# EAGLE design lt1345 (EAGLE 8.2.1)
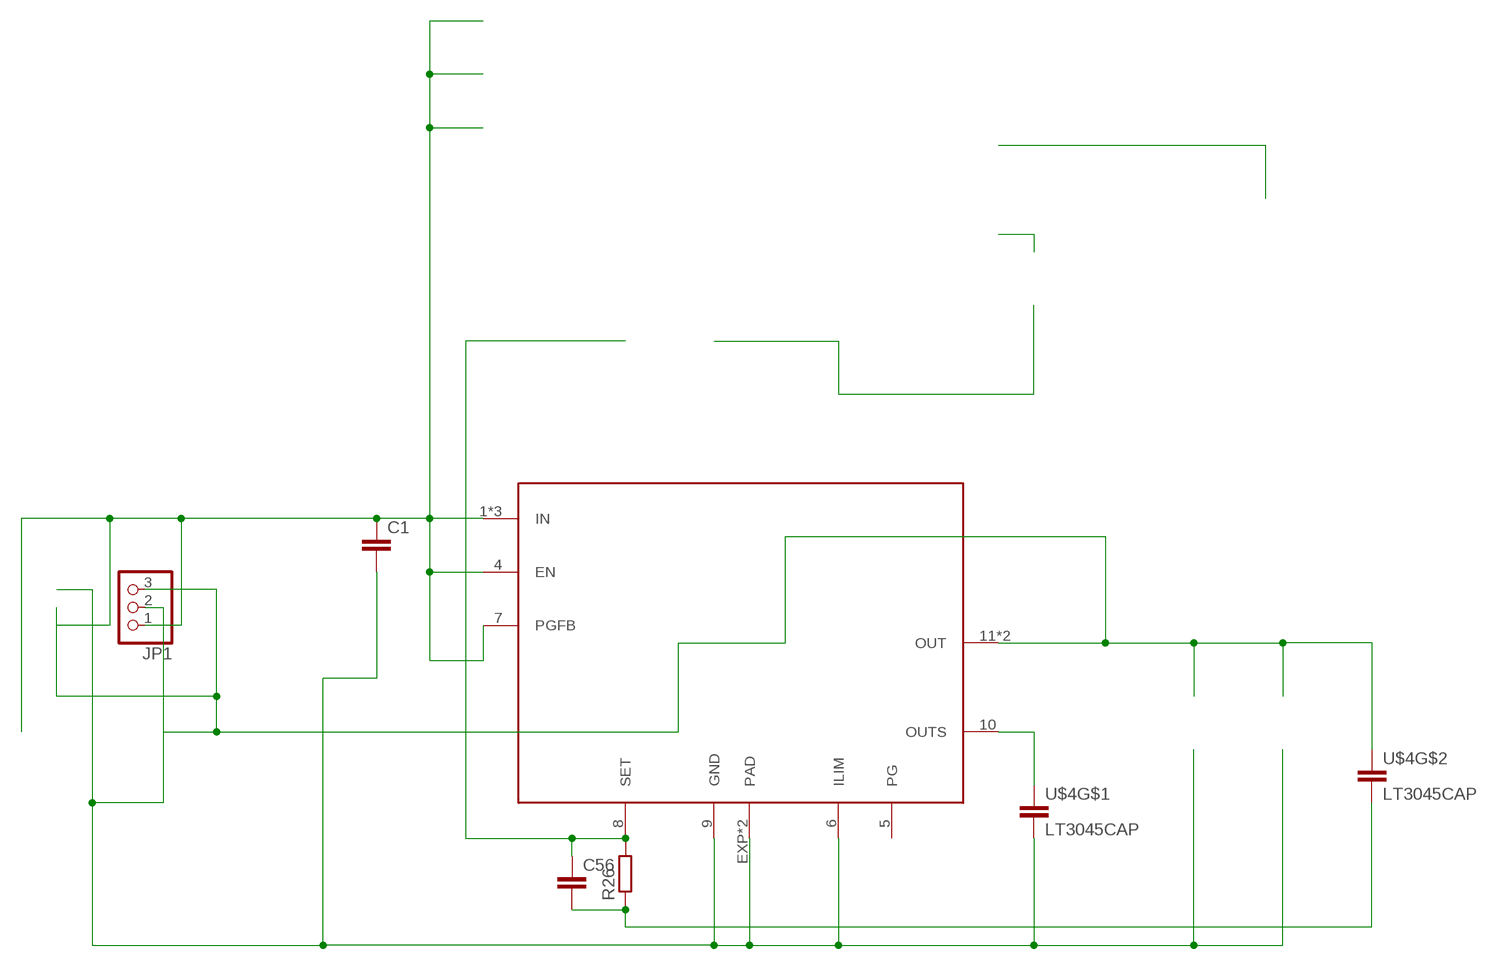
[diagram p0: schematic, sheet 1]

## Parts
C1  C-EUC1206  [C1206]
C56  C-EUC0805  [C0805]
JP1  PINHD-1X3  [1X03]
R26  R-EU_MELF0204R  [MINI_MELF-0204R]
U$2  LT3045  [MSOP12]
U$4  LT3045CAP  [LT3045CAP]

## Nets
GND: C1.2 JP1.2 U$2.6(ILIM) U$2.9(GND) U$2.EXP1(PAD) U$2.EXP(PAD) U$4.5
N$46: C56.1 R26.2 U$2.8(SET)
N$49: U$2.10(OUTS) U$4.3
N$54: C56.2 R26.1 U$4.6
VIN: C1.1 JP1.1 U$2.1(IN) U$2.2(IN) U$2.3(IN) U$2.4(EN) U$2.7(PGFB)
VOUT: JP1.3 U$2.11(OUT) U$2.12(OUT) U$4.4
Unconnected: U$2.5(PG)

## Library data of the parts
C1 C56 = Vwvwbg:C-EU: CAPACITOR, European symbol
JP1 = pinhead:PINHD-1X3: PIN HEADER
R26 = Vwvwbg:R-EU_: RESISTOR, European symbol
U$2 = Vwvwbg:LT3045
U$4 = Vwvwbg:LT3045CAP

## Board
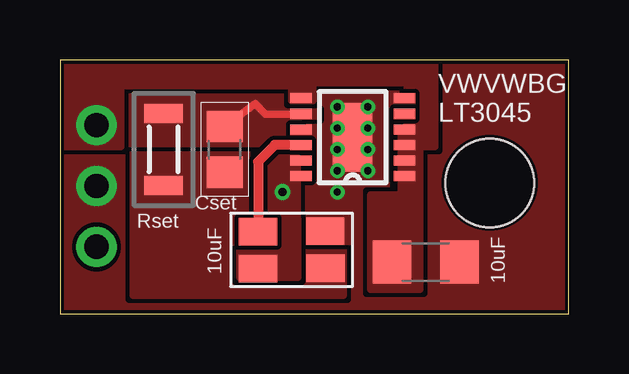
[diagram p1: board, top side]
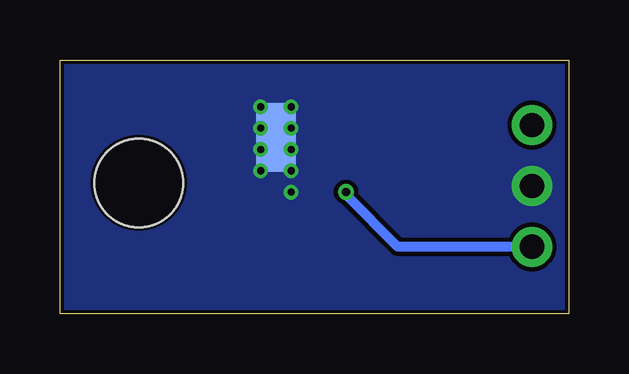
[diagram p2: board, bottom side, seen from below]

Size 21.19 x 10.59 mm. Coordinates in mm from the lower left corner, seen from the top.
Outline: 0,0 21.19,0 21.19,10.59 0,10.59 0,0
Copper layers (1*16): Top 0.035mm / dielectric 1.5mm / Bottom 0.035mm
Design rules "default *": minimum track width 6mil, minimum drill 0.3mm, track to track 7mil, track to pad 7mil, pad to pad 7mil, via to via 7mil, smd to smd 7mil, copper to edge 6mil, drill to drill 8mil, minimum pad ring 6mil, minimum via ring 6mil, stop-mask expansion 4mil, vias tented up to drill 0mil, thermal gap 10mil
Holes 3.68 mm at 17.91,5.46

### Footprints (pad centres in the part's own frame; a part is rotated, then mirrored left to right if it is on the bottom)
C1206 = smd 1.6 x 1.8: 1 -1.4,0; 2 1.4,0
C0805 = smd 1.3 x 1.5: 1 -0.95,0; 2 0.95,0
1X03 = drill 1.016 pad 1.676: 1 -2.54,0; 2 0,0; 3 2.54,0
MINI_MELF-0204R = smd 0.8 x 1.6: 1 -1.5,0; 2 1.5,0
MSOP12 = smd 0.9 x 0.42: 1 -2.163,1.625; 2 -2.163,0.975; 3 -2.163,0.325; 4 -2.163,-0.325; 5 -2.163,-0.975; 6 -2.163,-1.625; 7 2.15,-1.625; 8 2.15,-0.975; 9 2.15,-0.325; 10 2.15,0.325; 11 2.15,0.975; 12 2.15,1.625 | smd 1.65 x 2.85: EXP 0,0 | smd 1.65 x 2.85 bottom: EXP1 0,0
LT3045CAP = smd 1.6 x 1.143: 3 -1.394,0.767; 4 -1.4,-0.776; 5 1.402,0.776; 6 1.403,-0.767

### Placement (x,y rotation side)
C1  15.24,2.16 0 top
C56  6.86,6.86 270 top
JP1  1.52,5.33 270 top
R26  4.32,6.86 90 top
U$2  12.19,7.37 180 top
U$4  9.65,2.67 0 top

### Tracks (layer width: path | path; a pad name or v marks a point on that pad's centre or on a via)
GND  (via drill 0.3)
  other vias: 11.56,8.64 12.83,8.64 12.83,7.75 12.83,6.86 11.56,7.75 11.56,6.86 11.56,5.97 12.83,5.97 11.56,5.08
  pour Top (rank 4, no thermals): -5.97,12.19 24.89,12.19 24.89,-1.78 -5.97,-1.78
  pour Bottom (rank 2, no thermals): -5.97,12.19 24.89,12.19 24.89,-1.78 -5.97,-1.78
N$46
  Top 0.305: C56.1 8.12,8.77 8.55,8.34 U$2.8
  pour Top (rank 2, no thermals): 2.67,9.4 2.67,7.11 9.02,7.11 10.03,8.26 10.67,8.26 10.67,8.38 9.53,9.4
N$49
  Top 0.406: U$2.10 8.95,7.04 8.26,6.35 8.26,3.69 U$4.3
N$54
  pour Top (rank 3, no thermals): 8.13,6.73 3.05,6.73 3.05,0.76 11.81,0.76 11.81,2.79 9.91,2.79 9.91,1.27 8.13,1.27
VIN
  pour Top (no thermals): 14.48,6.99 14.48,9.65 10.54,9.65 10.54,8.89 9.65,8.89 9.65,9.53 2.54,9.53 2.54,6.99 -2.79,6.99 -2.79,11.68 15.62,11.68 15.62,6.99
  pour Top (no thermals): 14.22,7.75 14.22,4.95 12.95,4.95 12.95,1.02 14.99,1.02 14.99,7.75
VOUT  (via drill 0.35)
  Bottom 0.406: JP1.3 7.11,2.79 9.27,4.95 v9.27,5.08
  pour Top (no thermals): 9.89,6.52 8.37,6.52 8.38,2.92 7.49,2.92 7.49,1.52 9.91,1.52

### Text on the board
tPlace: VWVWBG / LT3045 | Cset | Rset | 10uF | 10uF